# Altium schematic sheet Sheet2.SchDoc
size A3; SheetNumber: 1; SheetTotal: 2
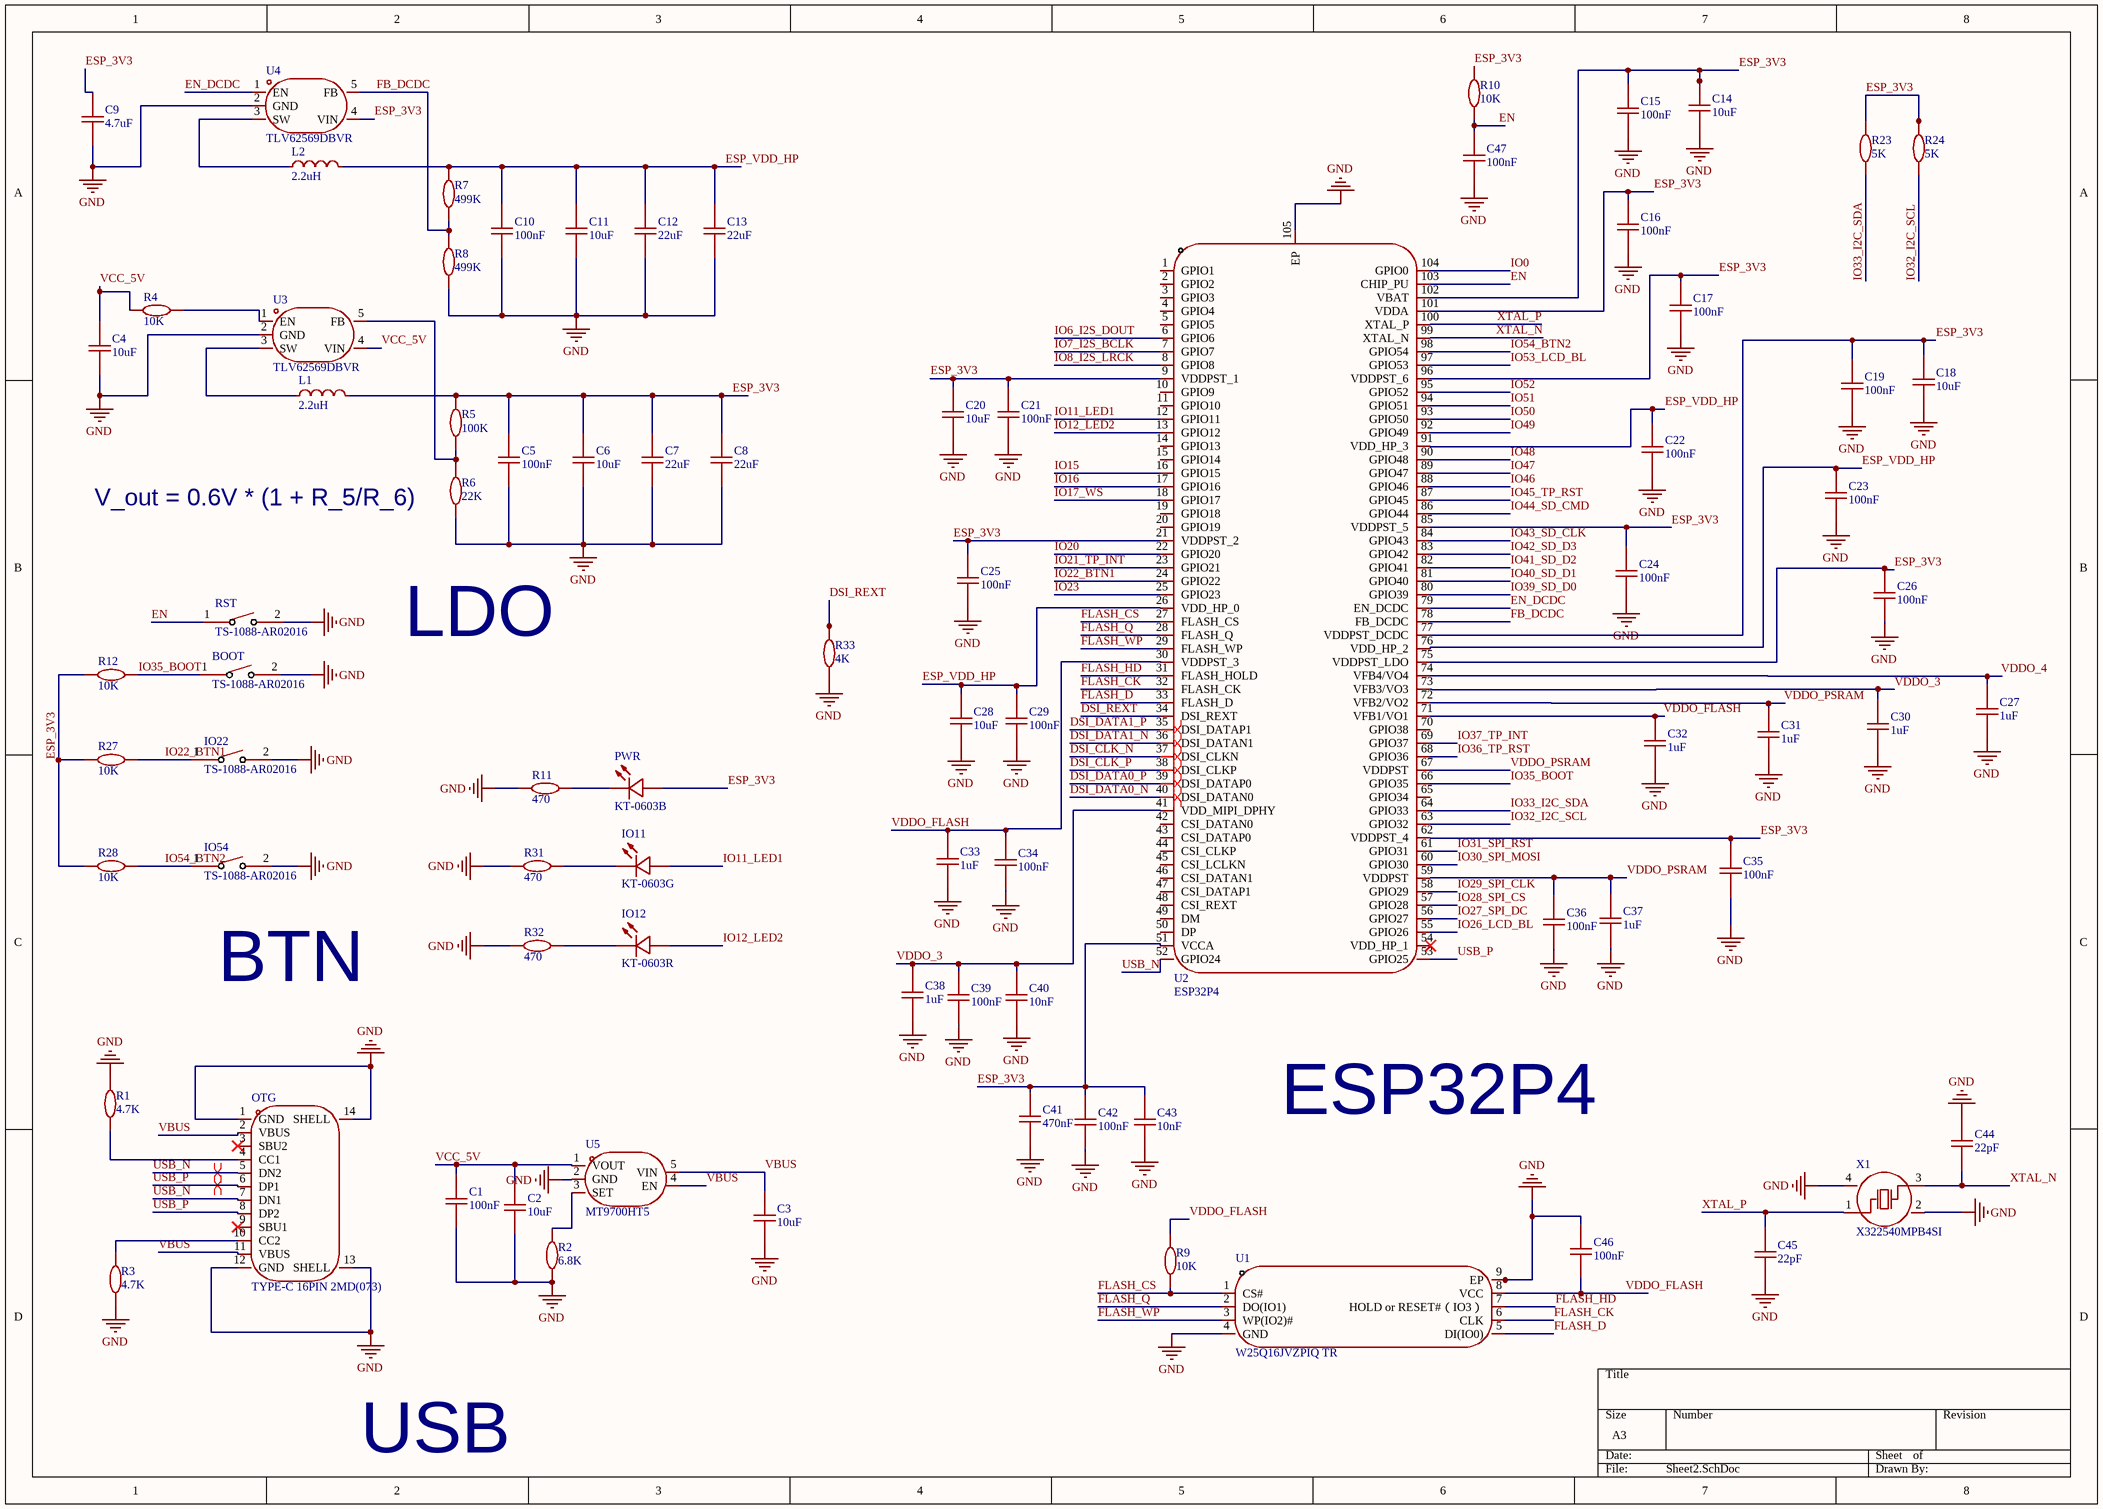
[diagram p0: Sheet2.SchDoc]

## Parts
BOOT  TS-1088-AR02016  [SW-SMD_L3.9-W3.0-P4.45]
C1  100nF  [C0402]
C2  10uF  [C0603]
C3  10uF  [C0603]
C4  10uF  [C0603]
C5  100nF  [C0402]
C6  10uF  [C0603]
C7  22uF  [C0603]
C8  22uF  [C0603]
C9  4.7uF  [C0603]
C10  100nF  [C0402]
C11  10uF  [C0603]
C12  22uF  [C0603]
C13  22uF  [C0603]
C14  10uF  [C0603]
C15  100nF  [C0402]
C16  100nF  [C0402]
C17  100nF  [C0402]
C18  10uF  [C0603]
C19  100nF  [C0402]
C20  10uF  [C0603]
C21  100nF  [C0402]
C22  100nF  [C0402]
C23  100nF  [C0402]
C24  100nF  [C0402]
C25  100nF  [C0402]
C26  100nF  [C0402]
C27  1uF  [C0402]
C28  10uF  [C0603]
C29  100nF  [C0402]
C30  1uF  [C0402]
C31  1uF  [C0402]
C32  1uF  [C0402]
C33  1uF  [C0402]
C34  100nF  [C0402]
C35  100nF  [C0402]
C36  100nF  [C0402]
C37  1uF  [C0402]
C38  1uF  [C0402]
C39  100nF  [C0402]
C40  10nF  [C0402]
C41  470nF  [C0402]
C42  100nF  [C0402]
C43  10nF  [C0402]
C44  22pF  [C0402]
C45  22pF  [C0402]
C46  100nF  [C0402]
C47  100nF  [C0402]
IO11  KT-0603G  [LED0603-GR]
IO12  KT-0603R  [LED0603-RD]
IO22  TS-1088-AR02016  [SW-SMD_L3.9-W3.0-P4.45]
IO54  TS-1088-AR02016  [SW-SMD_L3.9-W3.0-P4.45]
L1  2.2uH  [L0402-SMD]
L2  2.2uH  [L0402-SMD]
OTG  TYPE-C 16PIN 2MD(073)  [USB-C-SMD_TYPE-C-6PIN-2MD-073]
PWR  KT-0603B  [LED0603-BL]
R1  4.7K  [R0402]
R2  6.8K  [R0402]
R3  4.7K  [R0402]
R4  10K  [R0402]
R5  100K  [R0402]
R6  22K  [R0402]
R7  499K  [R0402]
R8  499K  [R0402]
R9  10K  [R0402]
R10  10K  [R0402]
R11  470  [R0402]
R12  10K  [R0402]
R23  5K  [R0402]
R24  5K  [R0402]
R27  10K  [R0402]
R28  10K  [R0402]
R31  470  [R0402]
R32  470  [R0402]
R33  4K  [R0402]
RST  TS-1088-AR02016  [SW-SMD_L3.9-W3.0-P4.45]
U1  W25Q16JVZPIQ TR  [WSON-8_L6.0-W5.0-P1.27-BL-EP]
U2  ESP32P4  [QFN-104_L10.0-W10.0-P0.35-TL-EP7.5]
U3  TLV62569DBVR  [SOT-23-5_L3.0-W1.7-P0.95-LS2.8-BR]
U4  TLV62569DBVR  [SOT-23-5_L3.0-W1.7-P0.95-LS2.8-BR]
U5  MT9700HT5  [SOT-23-5_L3.0-W1.7-P0.95-LS2.8-BL]
X1  X322540MPB4SI  [OSC-SMD_4P-L3.2-W2.5-BL_SIT8008BI]

## Nets
GND: BOOT.2 C1.1 C2.2 C3.2 C4.2 C5.1 C6.1 C7.1 C8.1 C9.2 C10.1 C11.1 C12.1 C13.1 C14.1 C15.1 C16.1 C17.1 C18.1 C19.1 C20.1 C21.1 C22.1 C23.1 C24.1 C25.1 C26.1 C27.1 C28.1 C29.1 C30.1 C31.1 C32.1 C33.1 C34.1 C35.1 C36.1 C37.1 C38.1 C39.1 C40.1 C41.1 C42.1 C43.1 C44.2 C45.1 C46.2 C47.1 IO22.2 IO54.2 OTG.1(GND) OTG.12(GND) OTG.13(SHELL) OTG.14(SHELL) R1.2 R2.2 R3.1 R6.1 R8.1 R11.2 R31.2 R32.2 R33.2 RST.2 U1.4(GND) U1.9(EP) U2.105(EP) U3.2(GND) U4.2(GND) U5.2(GND) X1.2(GND) X1.4(GND)
DSI_CLK_N: U2.37(DSI_CLKN)
DSI_CLK_P: U2.38(DSI_CLKP)
DSI_DATA0_N: U2.40(DSI_DATAN0)
DSI_DATA0_P: U2.39(DSI_DATAP0)
DSI_DATA1_N: U2.36(DSI_DATAN1)
DSI_DATA1_P: U2.35(DSI_DATAP1)
DSI_REXT: R33.1 U2.34(DSI_REXT)
EN: C47.2 R10.1 RST.1 U2.103(CHIP_PU)
EN_DCDC: U2.79(EN_DCDC) U4.1(EN)
ESP_3V3: C5.2 C6.2 C7.2 C8.2 C9.1 C14.2 C15.2 C16.2 C17.2 C18.2 C19.2 C20.2 C21.2 C24.2 C25.2 C26.2 C35.2 C41.2 C42.2 C43.2 L1.2 PWR.2(A) R5.2 R10.2 R12.2 R23.2 R24.2 R27.2 R28.2 U2.9(VDDPST_1) U2.21(VDDPST_2) U2.51(VCCA) U2.62(VDDPST_4) U2.75(VDDPST_LDO) U2.77(VDDPST_DCDC) U2.85(VDDPST_5) U2.96(VDDPST_6) U2.101(VDDA) U2.102(VBAT) U4.4(VIN)
ESP_VDD_HP: C10.2 C11.2 C12.2 C13.2 C22.2 C23.2 C28.2 C29.2 L2.2 R7.2 U2.26(VDD_HP_0) U2.76(VDD_HP_2) U2.91(VDD_HP_3)
FB_DCDC: R7.1 R8.2 U2.78(FB_DCDC) U4.5(FB)
FLASH_CK: U1.6(CLK) U2.32(FLASH_CK)
FLASH_CS: R9.1 U1.1(CS#) U2.27(FLASH_CS)
FLASH_D: U1.5(DI(IO0)) U2.33(FLASH_D)
FLASH_HD: U1.7(HOLD_or_RESET#（IO3）) U2.31(FLASH_HOLD)
FLASH_Q: U1.2(DO(IO1)) U2.28(FLASH_Q)
FLASH_WP: U1.3(WP(IO2)#) U2.29(FLASH_WP)
IO0: U2.104(GPIO0)
IO6_I2S_DOUT: U2.6(GPIO6)
IO7_I2S_BCLK: U2.7(GPIO7)
IO8_I2S_LRCK: U2.8(GPIO8)
IO11_LED1: IO11.2(A) U2.12(GPIO11)
IO12_LED2: IO12.2(A) U2.13(GPIO12)
IO15: U2.16(GPIO15)
IO16: U2.17(GPIO16)
IO17_WS: U2.18(GPIO17)
IO20: U2.22(GPIO20)
IO21_TP_INT: U2.23(GPIO21)
IO22_BTN1: IO22.1 R27.1 U2.24(GPIO22)
IO23: U2.25(GPIO23)
IO26_LCD_BL: U2.55(GPIO26)
IO27_SPI_DC: U2.56(GPIO27)
IO28_SPI_CS: U2.57(GPIO28)
IO29_SPI_CLK: U2.58(GPIO29)
IO30_SPI_MOSI: U2.60(GPIO30)
IO31_SPI_RST: U2.61(GPIO31)
IO32_I2C_SCL: R24.1 U2.63(GPIO32)
IO33_I2C_SDA: R23.1 U2.64(GPIO33)
IO35_BOOT: BOOT.1 R12.1 U2.66(GPIO35)
IO36_TP_RST: U2.68(GPIO36)
IO37_TP_INT: U2.69(GPIO37)
IO39_SD_D0: U2.80(GPIO39)
IO40_SD_D1: U2.81(GPIO40)
IO41_SD_D2: U2.82(GPIO41)
IO42_SD_D3: U2.83(GPIO42)
IO43_SD_CLK: U2.84(GPIO43)
IO44_SD_CMD: U2.86(GPIO44)
IO45_TP_RST: U2.87(GPIO45)
IO46: U2.88(GPIO46)
IO47: U2.89(GPIO47)
IO48: U2.90(GPIO48)
IO49: U2.92(GPIO49)
IO50: U2.93(GPIO50)
IO51: U2.94(GPIO51)
IO52: U2.95(GPIO52)
IO53_LCD_BL: U2.97(GPIO53)
IO54_BTN2: IO54.1 R28.1 U2.98(GPIO54)
USB_N: OTG.5(DN2) OTG.7(DN1) U2.52(GPIO24)
USB_P: OTG.6(DP1) OTG.8(DP2) U2.53(GPIO25)
VBUS: C3.1 OTG.2(VBUS) OTG.11(VBUS) U5.4(EN) U5.5(VIN)
VCC_5V: C1.2 C2.1 C4.1 R4.2 U3.4(VIN) U5.1(VOUT)
VDDO_3: C30.2 C38.2 C39.2 C40.2 U2.41(VDD_MIPI_DPHY) U2.73(VFB3/VO3)
VDDO_4: C27.2 U2.74(VFB4/VO4)
VDDO_FLASH: C32.2 C33.2 C34.2 C46.1 R9.2 U1.8(VCC) U2.30(VDDPST_3) U2.71(VFB1/VO1)
VDDO_PSRAM: C31.2 C36.2 C37.2 U2.59(VDDPST) U2.67(VDDPST) U2.72(VFB2/VO2)
XTAL_N: C44.1 U2.99(XTAL_N) X1.3(OSC2)
XTAL_P: C45.2 U2.100(XTAL_P) X1.1(OSC1)
NetIO11_1: IO11.1(K) R31.1
NetIO12_1: IO12.1(K) R32.1
NetL1_1: L1.1 U3.3(SW)
NetL2_1: L2.1 U4.3(SW)
NetOTG_4: OTG.4(CC1) R1.1
NetOTG_10: OTG.10(CC2) R3.2
NetPWR_1: PWR.1(K) R11.1
NetR2_1: R2.1 U5.3(SET)
NetR4_1: R4.1 U3.1(EN)
NetR5_1: R5.1 R6.2 U3.5(FB)

Not connected (* = marked no-connect by the designer): OTG 3(SBU2)* 9(SBU1)*; U2 1(GPIO1) 2(GPIO2) 3(GPIO3) 4(GPIO4) 5(GPIO5) 10(GPIO9) 11(GPIO10) 14(GPIO13) 15(GPIO14) 19(GPIO18) 20(GPIO19) 42(CSI_DATAN0) 43(CSI_DATAP0) 44(CSI_CLKP) 45(CSI_LCLKN) 46(CSI_DATAN1) 47(CSI_DATAP1) 48(CSI_REXT) 49(DM) 50(DP) 54(VDD_HP_1)* 65(GPIO34) 70(GPIO38)

## Layout directives
differential pair: DSI_CLK_N, DSI_CLK_P, DSI_DATA0_N, DSI_DATA0_P, DSI_DATA1_N, DSI_DATA1_P, USB_N, USB_P

## Notes on the sheet
- (near R6) V_out = 0.6V * (1 + R_5/R_6)
- LDO
- (near IO54) BTN
- ESP32P4
- USB

## Library data of the parts
C1 C5 C10 C15-C17 C19 C21-C27 C29-C47 = C0402
C2-C4 C6-C9 C11-C14 C18 C20 C28 = C0603
L1 L2 = L0402-SMD
R1-R12 R23 R24 R27 R28 R31-R33 = R0402